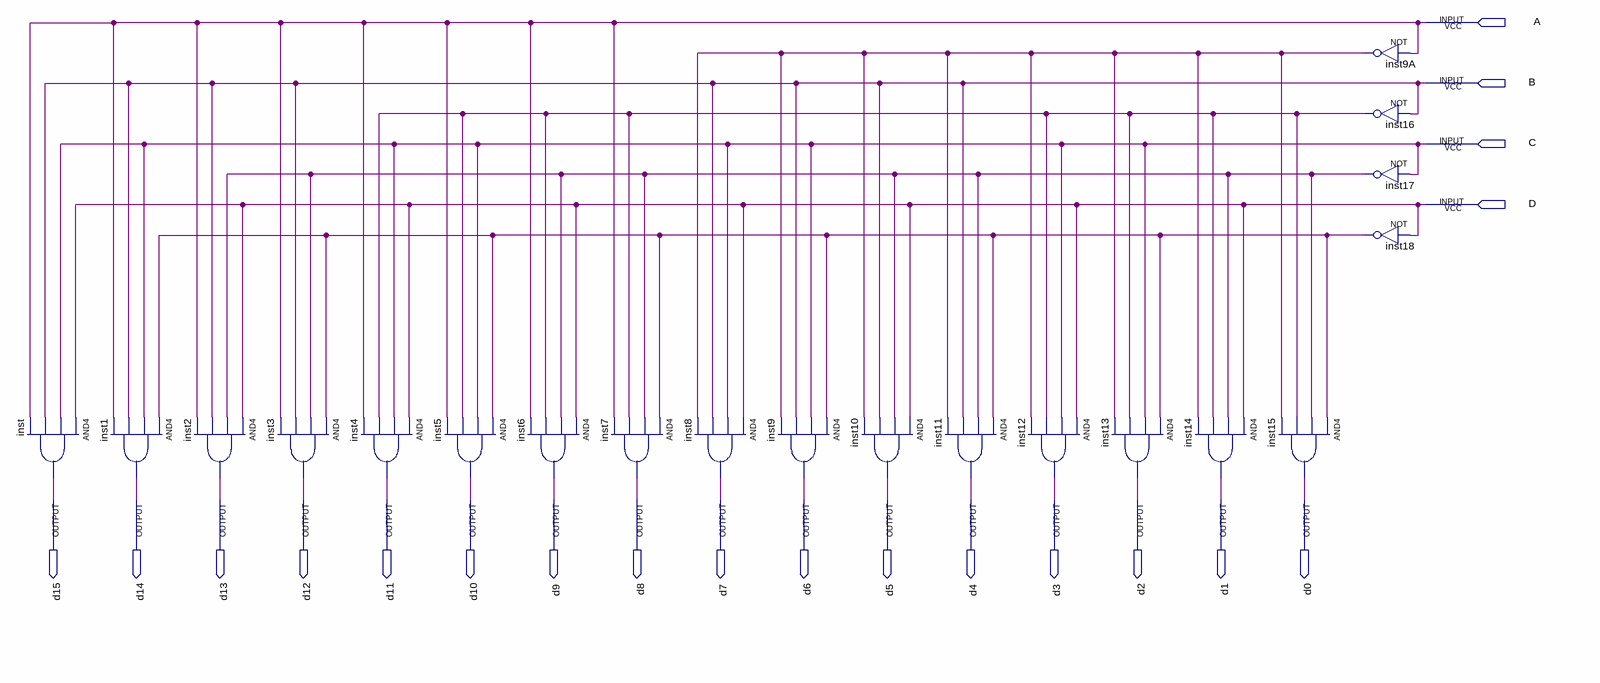
[diagram p0: schematic sheet]
// Quartus schematic decod.bdf as structural Verilog: 20 symbols, 20 pins
module decod (
  input  A,
  input  B,
  input  C,
  input  D,
  output d15,
  output d14,
  output d13,
  output d12,
  output d11,
  output d10,
  output d9,
  output d8,
  output d7,
  output d6,
  output d5,
  output d4,
  output d3,
  output d2,
  output d1,
  output d0
);

  wire inst9A_out, inst16_out, inst17_out, inst18_out;

  and inst (d15, D, C, B, A);
  and inst1 (d14, inst18_out, C, B, A);
  and inst2 (d13, D, inst17_out, B, A);
  and inst3 (d12, inst18_out, inst17_out, B, A);
  and inst4 (d11, D, C, inst16_out, A);
  and inst5 (d10, inst18_out, C, inst16_out, A);
  and inst6 (d9, D, inst17_out, inst16_out, A);
  and inst7 (d8, inst18_out, inst17_out, inst16_out, A);
  and inst8 (d7, D, C, B, inst9A_out);
  and inst9 (d6, inst18_out, C, B, inst9A_out);
  and inst10 (d5, D, inst17_out, B, inst9A_out);
  and inst11 (d4, inst18_out, inst17_out, B, inst9A_out);
  and inst12 (d3, D, C, inst16_out, inst9A_out);
  and inst13 (d2, inst18_out, C, inst16_out, inst9A_out);
  and inst14 (d1, D, inst17_out, inst16_out, inst9A_out);
  and inst15 (d0, inst18_out, inst17_out, inst16_out, inst9A_out);
  not inst9A (inst9A_out, A);
  not inst16 (inst16_out, B);
  not inst17 (inst17_out, C);
  not inst18 (inst18_out, D);
endmodule
